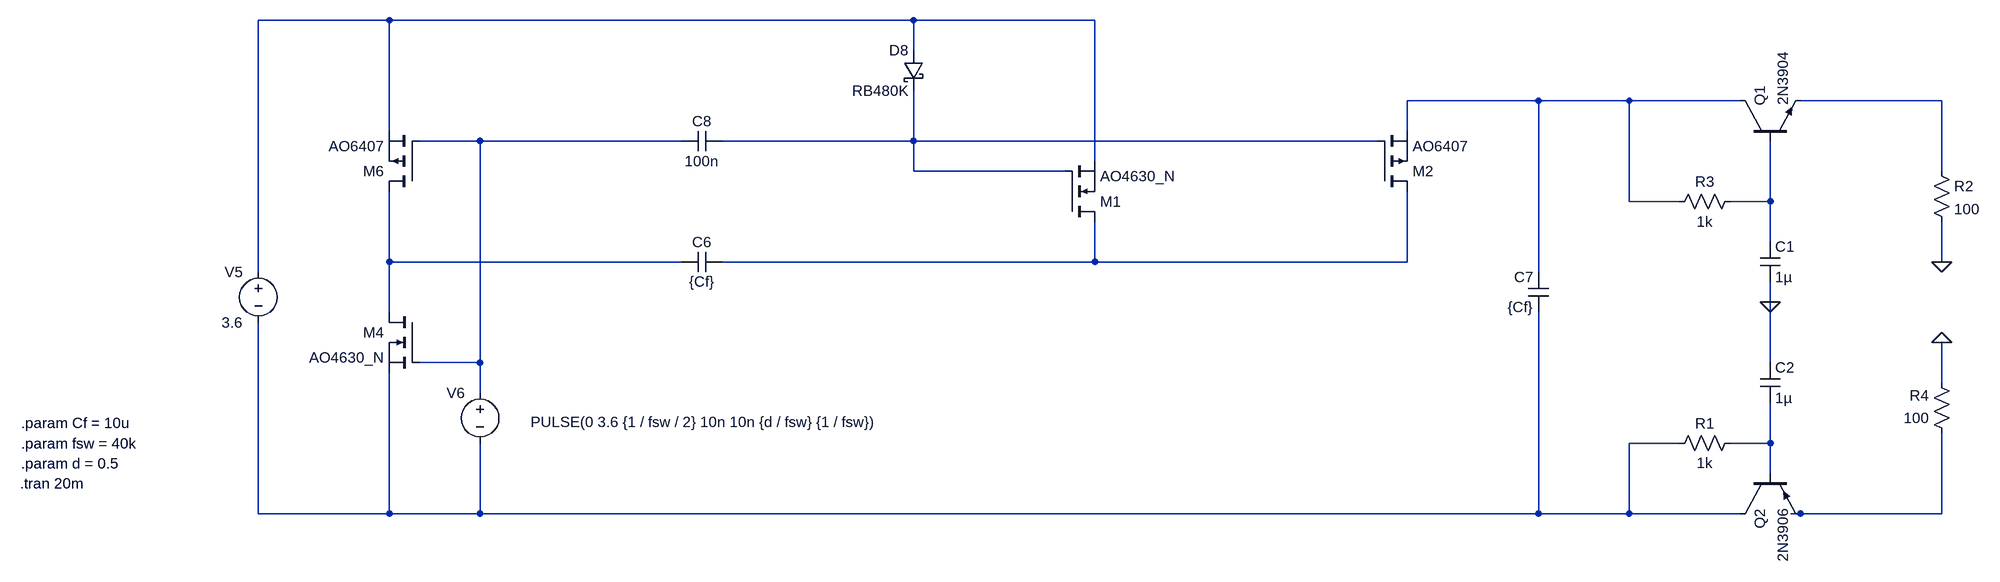
[diagram p0: schematic H-bridge_charge_pump_positive.asc]
H-bridge_charge_pump_positive.asc, the LTspice schematic file:
Version 4
SHEET 1 11460 3748
WIRE -416 208 -624 208
WIRE 416 208 -416 208
WIRE 704 208 416 208
WIRE 416 256 416 208
WIRE 1408 336 1200 336
WIRE 1552 336 1408 336
WIRE 1728 336 1552 336
WIRE 2048 336 1824 336
WIRE -416 384 -416 208
WIRE 1200 384 1200 336
WIRE -272 400 -368 400
WIRE 48 400 -272 400
WIRE 416 400 416 320
WIRE 416 400 112 400
WIRE 1152 400 416 400
WIRE 704 432 704 208
WIRE 416 448 416 400
WIRE 656 448 416 448
WIRE 2048 448 2048 336
WIRE 1552 496 1552 336
WIRE 1632 496 1552 496
WIRE 1776 496 1776 400
WIRE 1776 496 1712 496
WIRE 1776 560 1776 496
WIRE -416 592 -416 480
WIRE 48 592 -416 592
WIRE 704 592 704 528
WIRE 704 592 112 592
WIRE 1200 592 1200 480
WIRE 1200 592 704 592
WIRE 2048 592 2048 528
WIRE -624 608 -624 208
WIRE 1408 608 1408 336
WIRE 1776 656 1776 624
WIRE -416 672 -416 592
WIRE -272 752 -272 400
WIRE -272 752 -368 752
WIRE 1776 752 1776 656
WIRE 2048 784 2048 720
WIRE -272 800 -272 752
WIRE 1632 880 1552 880
WIRE 1776 880 1776 816
WIRE 1776 880 1712 880
WIRE 1776 928 1776 880
WIRE -624 992 -624 688
WIRE -416 992 -416 768
WIRE -416 992 -624 992
WIRE -272 992 -272 880
WIRE -272 992 -416 992
WIRE 1408 992 1408 672
WIRE 1408 992 -272 992
WIRE 1552 992 1552 880
WIRE 1552 992 1408 992
WIRE 1728 992 1552 992
WIRE 1824 992 1808 992
WIRE 2048 992 2048 864
WIRE 2048 992 1824 992
FLAG 1776 656 0
FLAG 2048 592 0
FLAG 2048 720 0
SYMBOL voltage -272 784 M0
WINDOW 123 0 0 Left 0
WINDOW 39 0 0 Left 0
WINDOW 3 -636 62 Left 2
SYMATTR InstName V6
SYMATTR Value PULSE(0 3.6 {1 / fsw / 2} 10n 10n {d / fsw} {1 / fsw})
SYMBOL cap 112 576 R90
WINDOW 0 0 32 VBottom 2
WINDOW 3 32 32 VTop 2
SYMATTR InstName C6
SYMATTR Value {Cf}
SYMBOL cap 1424 672 R180
WINDOW 0 24 56 Left 2
WINDOW 3 24 8 Left 2
SYMATTR InstName C7
SYMATTR Value {Cf}
SYMBOL nmos -368 672 M0
SYMATTR InstName M4
SYMATTR Value AO4630_N
SYMBOL pmos -368 480 R180
SYMATTR InstName M6
SYMATTR Value AO6407
SYMBOL cap 48 384 M90
WINDOW 0 0 32 VBottom 2
WINDOW 3 32 32 VTop 2
SYMATTR InstName C8
SYMATTR Value 100n
SYMBOL schottky 432 256 M0
SYMATTR InstName D8
SYMATTR Value RB480K
SYMATTR Description Diode
SYMATTR Type diode
SYMBOL voltage -624 592 M0
WINDOW 123 0 0 Left 0
WINDOW 39 0 0 Left 0
SYMATTR InstName V5
SYMATTR Value 3.6
SYMBOL pmos 1152 480 M180
SYMATTR InstName M2
SYMATTR Value AO6407
SYMBOL nmos 656 528 M180
SYMATTR InstName M1
SYMATTR Value AO4630_N
SYMBOL npn 1728 400 R270
SYMATTR InstName Q1
SYMATTR Value 2N3904
SYMBOL res 2032 432 R0
SYMATTR InstName R2
SYMATTR Value 100
SYMBOL res 1728 864 R90
WINDOW 0 0 56 VBottom 2
WINDOW 3 32 56 VTop 2
SYMATTR InstName R1
SYMATTR Value 1k
SYMBOL pnp 1728 928 M90
SYMATTR InstName Q2
SYMATTR Value 2N3906
SYMBOL res 2064 880 R180
WINDOW 0 36 76 Left 2
WINDOW 3 36 40 Left 2
SYMATTR InstName R4
SYMATTR Value 100
SYMBOL cap 1760 560 R0
SYMATTR InstName C1
SYMATTR Value 1µ
SYMBOL cap 1760 752 R0
SYMATTR InstName C2
SYMATTR Value 1µ
SYMBOL res 1728 480 R90
WINDOW 0 0 56 VBottom 2
WINDOW 3 32 56 VTop 2
SYMATTR InstName R3
SYMATTR Value 1k
TEXT -1000 880 Left 2 !.param fsw = 40k
TEXT -1000 912 Left 2 !.param d = 0.5
TEXT -1000 848 Left 2 !.param Cf = 10u
TEXT -1002 944 Left 2 !.tran 20m

The netlist it stands for:
* H-bridge_charge_pump_positive.asc
V6 N004 N009 PULSE(0 3.6 {1 / fsw / 2} 10n 10n {d / fsw} {1 / fsw})
C6 N008 N007 {Cf}
C7 N009 N002 {Cf}
M4 N007 N004 N009 N009 AO4630_N
M6 N007 N004 N001 N001 AO6407
C8 N004 N005 100n
D8 N001 N005 RB480K
V5 N001 N009 3.6
M2 N008 N005 N002 N002 AO6407
M1 N008 N005 N001 N001 AO4630_N
Q1 N002 N006 N003 0 2N3904
R2 N003 0 100
R1 N010 N009 1k
Q2 N009 N010 N011 0 2N3906
R4 N011 0 100
C1 N006 0 1µ
C2 0 N010 1µ
R3 N006 N002 1k
.model D D
.lib standard.dio
.model NPN NPN
.model PNP PNP
.lib standard.bjt
.model NMOS NMOS
.model PMOS PMOS
.lib standard.mos
.param fsw = 40k
.param d = 0.5
.param Cf = 10u
.tran 20m
.backanno
.end